# Altium schematic sheet ATMEGA2560-16AU.SchDoc
size A; SheetNumber: 3; SheetTotal: 15
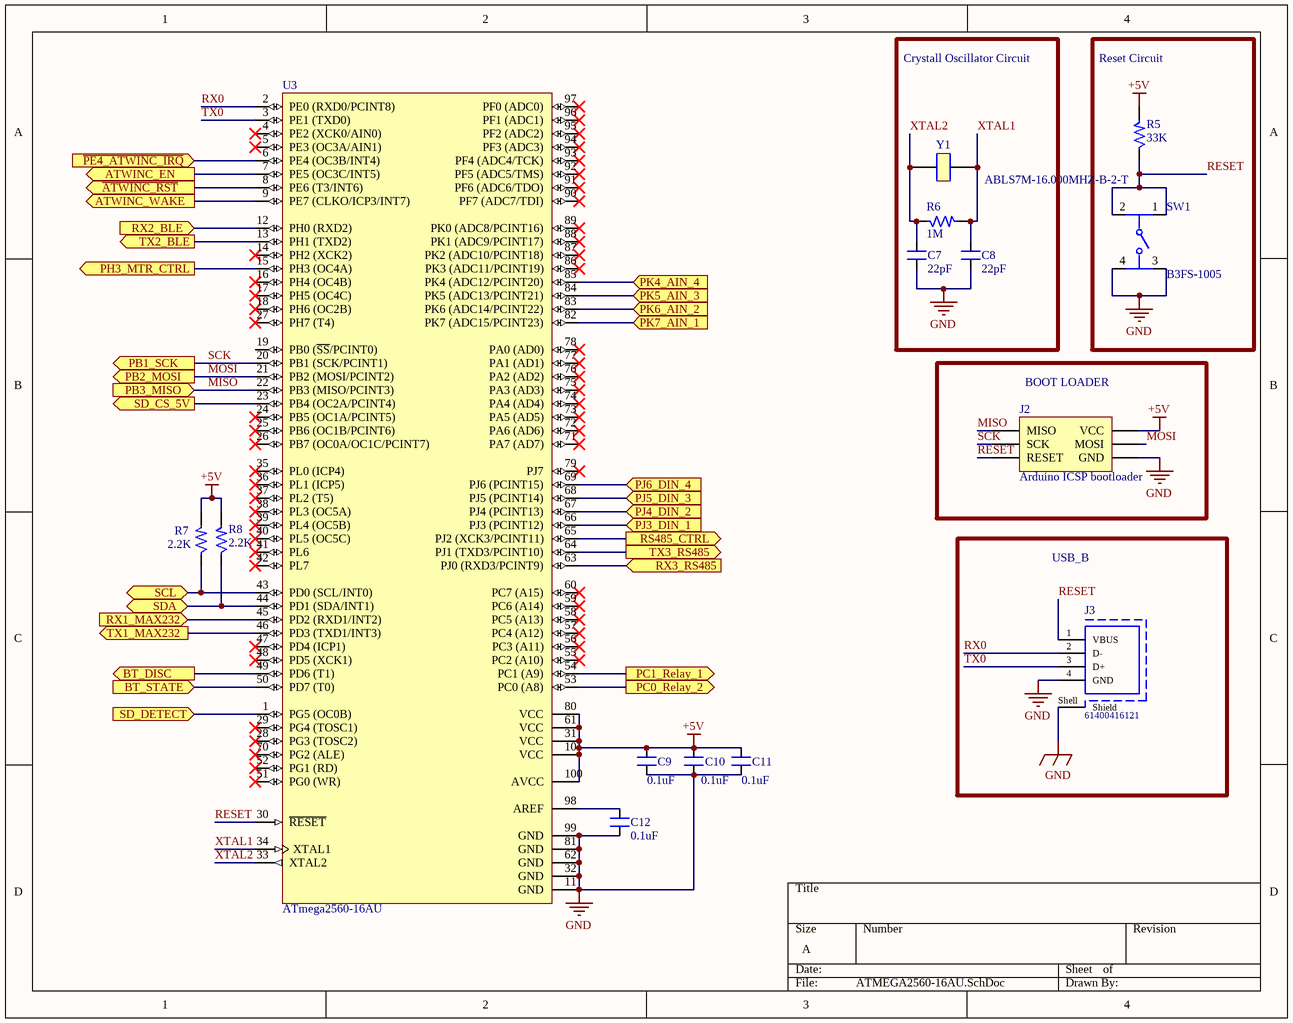
[diagram p0: ATMEGA2560-16AU.SchDoc]

## Parts
C7  22pF  [CAP_0805]
C8  22pF  [CAP_0805]
C9  0.1uF  [CAP_0805]
C10  0.1uF  [CAP_0805]
C11  0.1uF  [CAP_0805]
C12  0.1uF  [CAP_0805]
J2  Arduino ICSP bootloader  [HDR2X3]
J3  61400416121  [61400416121]
R5  33K  [RES_0805]
R6  1M  [RES_0805]
R7  2.2K  [RES_0805]
R8  2.2K  [RES_0805]
SW1  B3FS-1005  [FP-B3FS-1005-MFG]
U3  ATmega2560-16AU  [100A_L]
Y1  ABLS7M-16.000MHZ-B-2-T  [XTAL_314_240X47_SMD]

## Blocks framed on the sheet
Crystall Oscillator Circuit: C7 C8 R6 Y1
Reset Circuit: R5 SW1
BOOT LOADER: J2
USB_B: J3

## Ports
ATWINC_EN (out, see Block Diagram[4C], SPI Bus Transceiver[1C]), ATWINC_WAKE (out, see Block Diagram[4C], SPI Bus Transceiver[1C]), BT_DISC (out, see Block Diagram[4B], BLE[3B]), BT_STATE (in, see Block Diagram[4B], BLE[3B]), PB1_SCK (out, see Block Diagram[4C]), PB2_MOSI (out, see Block Diagram[4C]), PB3_MISO (in, see Block Diagram[4C]), PC0_Relay_2 (out, see Block Diagram[6B]), PC1_Relay_1 (out, see Block Diagram[6B]), PH3_MTR_CTRL (out, see Block Diagram[6B]), PJ3_DIN_1 (in, see Block Diagram[6B]), PJ4_DIN_2 (in, see Block Diagram[6B]), PJ5_DIN_3 (in, see Block Diagram[6B]), PJ6_DIN_4 (in, see Block Diagram[6B]), PK4_AIN_4 (in, see Block Diagram[6C]), PK5_AIN_3 (in, see Block Diagram[6C]), PK6_AIN_2 (in, see Block Diagram[6C]), PK7_AIN_1 (in, see Block Diagram[6C]), RS485_CTRL (out, see Block Diagram[4C], RS485[1B]), RX1_MAX232 (in, see Block Diagram[4B]), RX2_BLE (in, see Block Diagram[4B]), RX3_RS485 (in, see Block Diagram[4C]), SCL (bidir, see Block Diagram[5C], 4-20mA Sensor[4B], RTC[1B]), SD_CS_5V (out, see Block Diagram[4C], SPI Bus Transceiver[2C]), SD_DETECT (in, see Block Diagram[4C], SD Card[3B]), SDA (bidir, see Block Diagram[5C], 4-20mA Sensor[4B], RTC[1B]), TX1_MAX232 (out, see Block Diagram[4B]), TX2_BLE (out, see Block Diagram[4B]), TX3_RS485 (out, see Block Diagram[4C]), ~{ATWINC_RST} (out, see Block Diagram[4C], SPI Bus Transceiver[1C]), ~{PE4_ATWINC_IRQ} (in, see Block Diagram[4C])

## Nets
+5V: C9.2 C10.2 C11.2 J2.2(VCC) R5.2 R7.2 R8.2 U3.10(VCC) U3.31(VCC) U3.61(VCC) U3.80(VCC) U3.100(AVCC)
GND: C7.1 C8.1 C9.1 C10.1 C11.1 C12.1 J2.6(GND) J3.4(GND) J3.Shell(Shield) SW1.3 SW1.4 U3.11(GND) U3.32(GND) U3.62(GND) U3.81(GND) U3.99(GND)
~{ATWINC_RST}: U3.8(PE6_(T3/INT6)) ; port ~{ATWINC_RST}
~{PE4_ATWINC_IRQ}: U3.6(PE4_(OC3B/INT4)) ; port ~{PE4_ATWINC_IRQ}
ATWINC_EN: U3.7(PE5_(OC3C/INT5)) ; port ATWINC_EN
ATWINC_WAKE: U3.9(PE7_(CLKO/ICP3/INT7)) ; port ATWINC_WAKE
BT_DISC: U3.49(PD6_(T1)) ; port BT_DISC
BT_STATE: U3.50(PD7_(T0)) ; port BT_STATE
MISO: J2.1(MISO) U3.22(PB3_(MISO/PCINT3)) ; port PB3_MISO
MOSI: J2.4(MOSI) U3.21(PB2_(MOSI/PCINT2)) ; port PB2_MOSI
PC0_Relay_2: U3.53(PC0_(A8)) ; port PC0_Relay_2
PC1_Relay_1: U3.54(PC1_(A9)) ; port PC1_Relay_1
PH3_MTR_CTRL: U3.15(PH3_(OC4A)) ; port PH3_MTR_CTRL
PJ3_DIN_1: U3.66(PJ3_(PCINT12)) ; port PJ3_DIN_1
PJ4_DIN_2: U3.67(PJ4_(PCINT13)) ; port PJ4_DIN_2
PJ5_DIN_3: U3.68(PJ5_(PCINT14)) ; port PJ5_DIN_3
PJ6_DIN_4: U3.69(PJ6_(PCINT15)) ; port PJ6_DIN_4
PK4_AIN_4: U3.85(PK4_(ADC12/PCINT20)) ; port PK4_AIN_4
PK5_AIN_3: U3.84(PK5_(ADC13/PCINT21)) ; port PK5_AIN_3
PK6_AIN_2: U3.83(PK6_(ADC14/PCINT22)) ; port PK6_AIN_2
PK7_AIN_1: U3.82(PK7_(ADC15/PCINT23)) ; port PK7_AIN_1
RESET: J2.5(RESET) J3.1(VBUS) R5.1 SW1.1 SW1.2 U3.30(~{RESET})
RS485_CTRL: U3.65(PJ2_(XCK3/PCINT11)) ; port RS485_CTRL
RX0: J3.2(D-) U3.2(PE0_(RXD0/PCINT8))
RX1_MAX232: U3.45(PD2_(RXD1/INT2)) ; port RX1_MAX232
RX2_BLE: U3.12(PH0_(RXD2)) ; port RX2_BLE
RX3_RS485: U3.63(PJ0_(RXD3/PCINT9)) ; port RX3_RS485
SCK: J2.3(SCK) U3.20(PB1_(SCK/PCINT1)) ; port PB1_SCK
SCL: R7.1 U3.43(PD0_(SCL/INT0)) ; port SCL
SD_CS_5V: U3.23(PB4_(OC2A/PCINT4)) ; port SD_CS_5V
SD_DETECT: U3.1(PG5_(OC0B)) ; port SD_DETECT
SDA: R8.1 U3.44(PD1_(SDA/INT1)) ; port SDA
TX0: J3.3(D+) U3.3(PE1_(TXD0))
TX1_MAX232: U3.46(PD3_(TXD1/INT3)) ; port TX1_MAX232
TX2_BLE: U3.13(PH1_(TXD2)) ; port TX2_BLE
TX3_RS485: U3.64(PJ1_(TXD3/PCINT10)) ; port TX3_RS485
XTAL1: C8.2 R6.2 U3.34(XTAL1) Y1.2
XTAL2: C7.2 R6.1 U3.33(XTAL2) Y1.1
NetC12_2: C12.2 U3.98(AREF)

Not connected (* = marked no-connect by the designer): U3 4(PE2_(XCK0/AIN0))* 5(PE3_(OC3A/AIN1))* 14(PH2_(XCK2))* 16(PH4_(OC4B))* 17(PH5_(OC4C))* 18(PH6_(OC2B))* 19(PB0_(~{SS}/PCINT0)) 24(PB5_(OC1A/PCINT5))* 25(PB6_(OC1B/PCINT6))* 26(PB7_(OC0A/OC1C/PCINT7))* 27(PH7_(T4))* 28(PG3_(TOSC2))* 29(PG4_(TOSC1))* 35(PL0_(ICP4))* 36(PL1_(ICP5))* 37(PL2_(T5))* 38(PL3_(OC5A))* 39(PL4_(OC5B))* 40(PL5_(OC5C))* 41(PL6)* 42(PL7)* 47(PD4_(ICP1))* 48(PD5_(XCK1))* 51(PG0_(WR))* 52(PG1_(RD))* 55(PC2_(A10))* 56(PC3_(A11))* 57(PC4_(A12))* 58(PC5_(A13))* 59(PC6_(A14))* 60(PC7_(A15))* 70(PG2_(ALE))* 71(PA7_(AD7))* 72(PA6_(AD6))* 73(PA5_(AD5))* 74(PA4_(AD4))* 75(PA3_(AD3))* 76(PA2_(AD2))* 77(PA1_(AD1))* 78(PA0_(AD0))* 79(PJ7)* 86(PK3_(ADC11/PCINT19))* 87(PK2_(ADC10/PCINT18))* 88(PK1_(ADC9/PCINT17))* 89(PK0_(ADC8/PCINT16))* 90(PF7_(ADC7/TDI))* 91(PF6_(ADC6/TDO))* 92(PF5_(ADC5/TMS))* 93(PF4_(ADC4/TCK))* 94(PF3_(ADC3))* 95(PF2_(ADC2))* 96(PF1_(ADC1))* 97(PF0_(ADC0))*

## Library data of the parts
C7 C8 = CAP_22PF-50V-5%-0805: 22pF ±5% 50V Ceramic Capacitor C0G, NP0 0805 (2012 Metric); Manufacturer: Yageo; Manufacturer Part Number: CC0805JRNPO9BN220; Alternate Part Number-1: 0805CG220J500NT; Case/Package: 0805; Supplier-1: SIRICOM; Supplier Part Number-1: 0805N220J500CT
C9-C12 = CAP_0.1uF-50V-5%-0805: 0.1µF ±5% 50V Ceramic Capacitor X7R 0805 (2012 Metric); Manufacturer: AVX Corporation; Manufacturer Part Number: 08055C104JAT4A; Alternate Part Number-1: 0805B104M500; Case/Package: 0805; Supplier-1: SIRICOM; Supplier Part Number-1: 0805B104J500CT
J2 = ICSP: Header, 3-Pin, Dual row; LatestRevisionDate: 17-Jul-2002; LatestRevisionNote: Re-released for DXP Platform.; Publisher: Altium Limited
J3 = CON_USB-2.0-B-TH: USB 2.0 Type B Receptacle WR-COM, Horizontal, THT, with Pads and Pegs; Manufacturer: Wurth Elektronik; Contact Resistance: 20mOhm; Rated Current: 1.5A; Working Voltage: 30VAC; Package Reference: 61400416121; Part Number: 61400416121; Packaging: Tray; Mounting Technology: THT; Gender: Receptacle; Datasheet URL: https://katalog.we-online.de/em/datasheet/61400416121.pdf; Publisher: WurthElektronik; Orientation: Horizontal; Connector Type: USB2.0TypeB; Operating Temperature: -40to105degC; Manufacturer URL: http://www.we-online.de
R5 = RES_33K-0.125W-1%-0805: Thick Film Resistors - SMD 33KOhms 1/8W 150V33 kOhms ±1% 0.125W, 1/8W Chip Resistor 0805 (2012 Metric) Thick Film; Manufacturer: Vishay BCcomponents; Manufacturer Part Number: CRG0805F33K; Alternate Part Number-1: NA; Case/Package: 0805; Supplier-1: SIRICOM; Supplier Part Number-1: WR08X3302FTL
R6 = RES_1M-0.125W-1%-0805: 1 MOhms ±1% 0.125W, 1/8W Chip Resistor 0805 (2012 Metric) Automotive AEC-Q200 Thick Film; Manufacturer: Walsin; Manufacturer Part Number: WR08X1004FTL; Alternate Part Number-1: 0805W8F1004T5E; Case/Package: 0805; Supplier-1: SIRICOM; Supplier Part Number-1: WR08X1004FTL
R7 R8 = RES_2.2K-0.125W-1%-0805: 2.2 kOhms ±1% 0.125W, 1/8W Chip Resistor 0805 (2012 Metric) Thick Film; Manufacturer: Stackpole Electronics; Manufacturer Part Number: CRG0805F2K2; Alternate Part Number-1: CR0805F82201G; Case/Package: 0805; Supplier-1: SIRICOM; Supplier Part Number-1: WR08X2201FTL
SW1 = SWITCH TACTILE SPST: SWITCH TACTILE SPST-NO 0.05A 24V; Operating Force: 2.55N; Ratings: IP00; Illumination Type: Non-Illuminated; Switch Travel: 0.25mm; Electrical Life: 100000Cycles; Current Rating: 50mA; Mechanical Life: 300000Cycles; Switch Function: Off-Mom; Actuator Type: Standard; Throw Configuration: SPST; Number of Poles: 1; Actuator Length: 0.5mm; RoHS Compliant: Yes; Packaging: Bulk; Termination: Gull Wing; Max Operating Temperature: 70°C; Weight: 0.2g; Min Operating Temperature: -25°C; Contact Material: Silver; Length: 6mm; Height: 3.1mm; Mount: Surface Mount; Contact Current Rating: 50mA; Lead Free: Lead Free; Max Voltage Rating (DC): 24V; Orientation: Straight; Package Quantity: 100; Voltage Rating (DC): 24V; Series: B3FS; Width: 6mm
U3 = ATmega2560-16AU: 8-bit AVR Microcontroller, 4.5-5.5V, 16MHz, 256KB Flash, 4KB EEPROM, 8KB SRAM, 86 GPIO pins, 100-pin TQFP, Industrial Grade (-40°C to 85°C), Pb-Free; PackageDescription: 100-Pin Thin Profile Plastic Quad Flat Pack (TQFP), 14 x 14 x 1.0 mm Body, 0.5 mm Pitch; ComponentLink1Description: Manufacturer URL; ComponentLink3URL: http://www.atmel.com/dyn/resources/prod_documents/2549S.pdf; RevisionNote: DatasheetVersion & PackageVersion updated. URLs added.; DatasheetVersion: revN, May-2011; ComponentLink2Description: ATmega640/1280/1281/2560/2561 Datasheet; PackageReference: 100A; PackageVersion: revD, Oct-2010; Code_JEDEC: MS-026-AED; ComponentLink1URL: http://www.atmel.com/; ComponentLink2URL: http://www.atmel.com/dyn/resources/prod_documents/doc2549.pdf; ComponentLink3Description: ATmega640/1280/1281/2560/2561 Summary
Y1 = XTAL_16MHz-ABLS7M-16.000MHZ-B-2-T: 16MHz ±20ppm Crystal 18pF 60 Ohms 2-SMD, Flat Lead; Manufacturer: Abracon; Alternate Part Number-1: NA; Manufacturer Part Number: ABLS7M-16.000MHZ-B-2-T; Case/Package: SMD; Supplier-1: ARROW; Supplier Part Number-1: ABLS7M-16.000MHZ-B-2-T